# EAGLE schematic vibhub_0.1 (EAGLE 8.6.1)

## Sheet 1 of 2
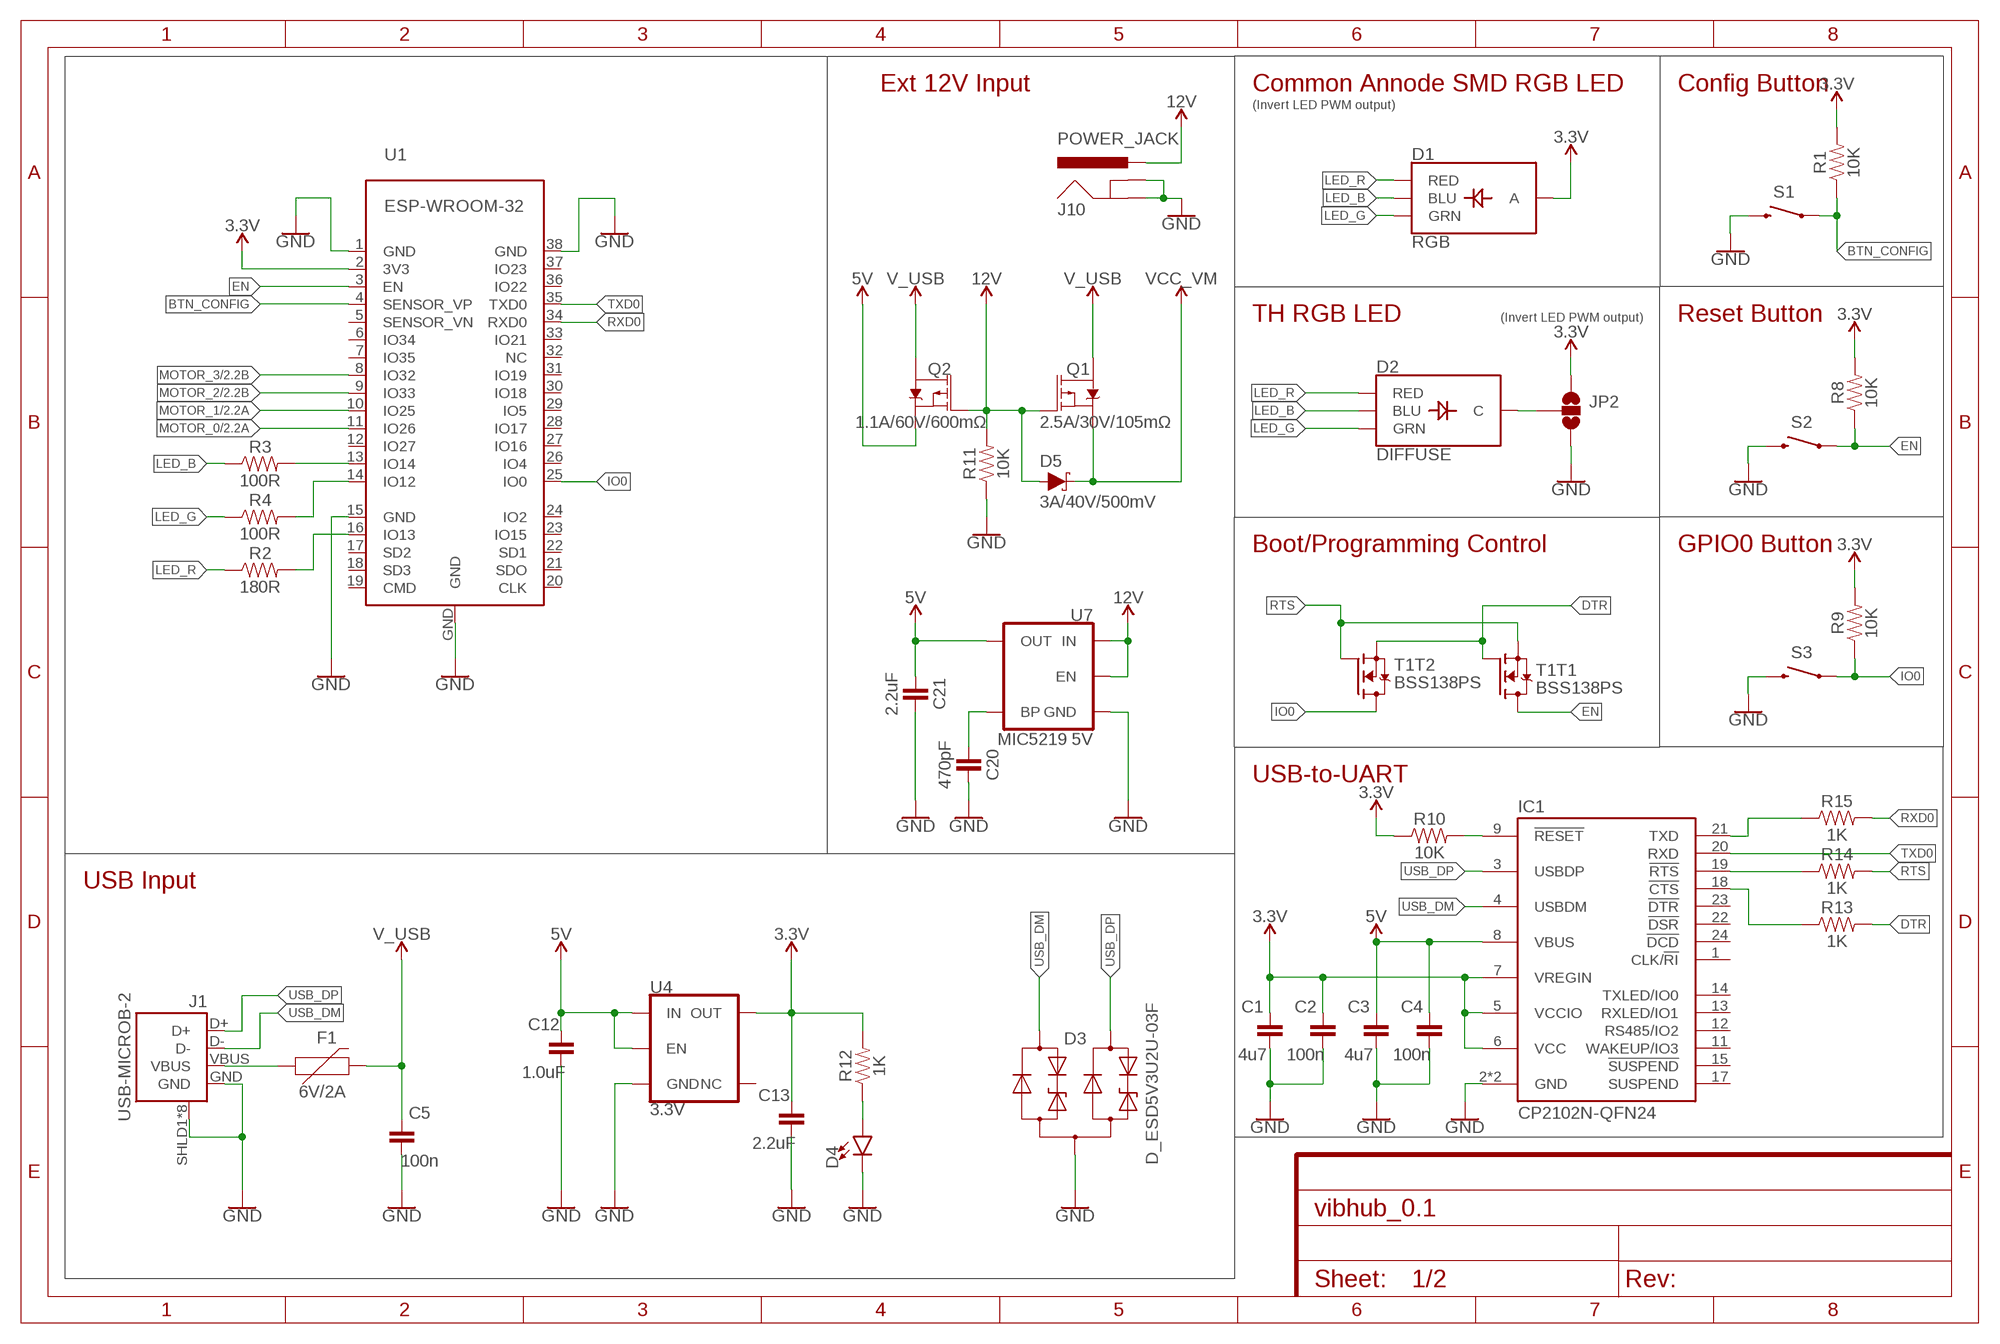
[diagram p0: schematic, sheet 1]
FRAME1 (FRAME-A4L): CNAME: VibHud ESP32; CREVISION: 0.1; DESIGNER: Kadah

### Parts
C1  4u7  CAPACITOR-1206  [C1206]
C2  100n  CAPACITOR-1206  [C1206]
C3  4u7  CAPACITOR-1206  [C1206]
C4  100n  CAPACITOR-1206  [C1206]
C5  100n  CAPACITOR-1206  [C1206]
C12  1.0uF  CAPACITOR-0805  [C0805]
C13  2.2uF  CAPACITOR-0805  [C0805]
C20  470pF  CAPACITOR-0805  [C0805]
C21  2.2uF  CAPACITOR-0805  [C0805]
D1  RGB  LED-RGB-CAPLCC  [P-LCC-4-3]
D2  DIFFUSE  LED-RGB-CCDIFFUSE  [LED-RGB-THRU]
D3  D_ESD5V3U2U-03F  [SOT723]
D4  LED1206  [LED-1206]
D5  3A/40V/500mV  DIODE-SCHOTTKY-B340A  [SMA-DIODE]
F1  6V/2A  PPTC_HALF-AMP  [1206]
IC1  CP2102N-QFN24  [QFN24-PAD]
J1  USB-MICROB-2  [USB-MICROB-10118194]
J10  POWER_JACK  [POWER_JACK_PTH]
JP2  JUMPER-SMT_3_NO_SILK  [SMT-JUMPER_3_NO_SILK]
Q1  2.5A/30V/105mΩ  MOSFET_PCH-DMG2307L  [SOT23-3]
Q2  1.1A/60V/600mΩ  MOSFET_PCH-SI2309DS  [SOT23-3]
R1  10K  RESISTOR0805  [0805]
R2  180R  RESISTOR0805  [0805]
R3  100R  RESISTOR0805  [0805]
R4  100R  RESISTOR0805  [0805]
R8  10K  RESISTOR0805  [0805]
R9  10K  RESISTOR0805  [0805]
R10  10K  RESISTOR0805  [0805]
R11  10K  RESISTOR0805  [0805]
R12  1K  RESISTOR0805  [0805]
R13  1K  RESISTOR0805  [0805]
R14  1K  RESISTOR0805  [0805]
R15  1K  RESISTOR0805  [0805]
S1  MOMENTARY-SWITCH-SPST-PTH-6.0MM  [TACTILE_SWITCH_PTH_6.0MM]
S2  MOMENTARY-SWITCH-SPST-PTH-6.0MM  [TACTILE_SWITCH_PTH_6.0MM]
S3  MOMENTARY-SWITCH-SPST-PTH-6.0MM  [TACTILE_SWITCH_PTH_6.0MM]
T1  BSS138PS  [SOT363]
U1  ESP-WROOM-32  [ESP-WROOM-32]
U4  3.3V  V_REG_AP2112K-3.3V  [SOT23-5]
U7  MIC5219 5V  V_REG_MIC52195V  [SOT23-5]

### Nets
3.3V: C1.1 C2.1 C13.1 D1.4(A) IC1.5(VCCIO) IC1.6(VCC) IC1.7(VREGIN) JP2.1 R1.2 R8.2 R9.2 R10.1 R12.2 U1.2(3V3) U4.5(OUT) ; also sheet 2
5V: C3.1 C4.1 C12.1 C21.2 IC1.8(VBUS) Q2.2(S) U4.1(IN) U4.3(EN) U7.5(OUT)
12V: D5.A J10.PWR Q1.1(G) Q2.1(G) R11.2 U7.1(IN) U7.3(EN)
BTN_CONFIG: R1.1 S1.1 U1.4(SENSOR_VP)
DTR: R13.2 T1.2(T1:G) T1.4(T2:S)
EN: R8.1 S2.1 T1.6(T1:D) U1.3(EN)
GND: C1.2 C2.2 C3.2 C4.2 C5.2 C12.2 C13.2 C20.1 C21.1 D3.3(A) D4.C IC1.2(GND) IC1.TP(GND) J1.GND J1.SHLD1(SHIELD) J1.SHLD2(SHIELD) J1.SHLD3(SHIELD) J1.SHLD4(SHIELD) J1.SHLD5(SHIELD) J1.SHLD6(SHIELD) J1.SHLD7(SHIELD) J1.SHLD8(SHIELD) J10.GND J10.GNDBREAK JP2.3 R11.1 S1.3 S2.3 S3.3 U1.1(GND) U1.15(GND) U1.38(GND) U1.GND U4.2(GND) U7.2(GND) ; also sheet 2
IO0: R9.1 S3.1 T1.3(T2:D) U1.25(IO0)
LED_B: D1.3(BLU) D2.4(BLU) R3.1
LED_G: D1.2(GRN) D2.3(GRN) R4.1
LED_R: D1.1(RED) D2.1(RED) R2.1
MOTOR_0: U1.11(IO26) ; also sheet 2
MOTOR_1: U1.10(IO25) ; also sheet 2
MOTOR_2: U1.9(IO33) ; also sheet 2
MOTOR_3: U1.8(IO32) ; also sheet 2
N$1: D2.2(C) JP2.2
N$3: R2.2 U1.16(IO13)
N$4: C20.2 U7.4(BP)
N$5: F1.1 J1.VBUS
N$7: IC1.9(!RESET) R10.2
N$8: IC1.21(TXD) R15.1
N$9: IC1.19(!RTS) R14.1
N$10: IC1.18(!CTS) R13.1
N$11: D4.A R12.1
N$12: R3.2 U1.13(IO14)
N$13: R4.2 U1.14(IO12)
RTS: R14.2 T1.1(T1:S) T1.5(T2:G)
RXD0: R15.2 U1.34(RXD0)
TXD0: IC1.20(RXD) U1.35(TXD0)
USB_DM: D3.1(C1) IC1.4(USBDM) J1.D-
USB_DP: D3.2(C2) IC1.3(USBDP) J1.D+
V_USB: C5.1 F1.2 Q1.3(D) Q2.3(D)
VCC_1: D5.C Q1.2(S) ; supply symbol labelled VCC_VM ; also sheet 2
Unconnected: IC1.1(CLK/!RI) IC1.11(WAKEUP/IO3) IC1.12(RS485/IO2) IC1.13(RXLED/IO1) IC1.14(TXLED/IO0) IC1.15(!SUSPEND) IC1.17(SUSPEND) IC1.22(!DSR) IC1.23(!DTR) IC1.24(!DCD) U1.5(SENSOR_VN) U1.6(IO34) U1.7(IO35) U1.12(IO27) U1.17(SD2) U1.18(SD3) U1.19(CMD) U1.20(CLK) U1.21(SDO) U1.22(SD1) U1.23(IO15) U1.24(IO2) U1.26(IO4) U1.27(IO16) U1.28(IO17) U1.29(IO5) U1.30(IO18) U1.31(IO19) U1.32(NC) U1.33(IO21) U1.36(IO22) U1.37(IO23) U4.4(NC)

### Notes on the sheet
- Ext 12V Input | Common Annode SMD RGB LED | Config Button
- (Invert LED PWM output)
- TH RGB LED | Reset Button
- (Invert LED PWM output)
- Boot/Programming Control | GPIO0 Button
- USB-to-UART
- USB Input

## Sheet 2 of 2
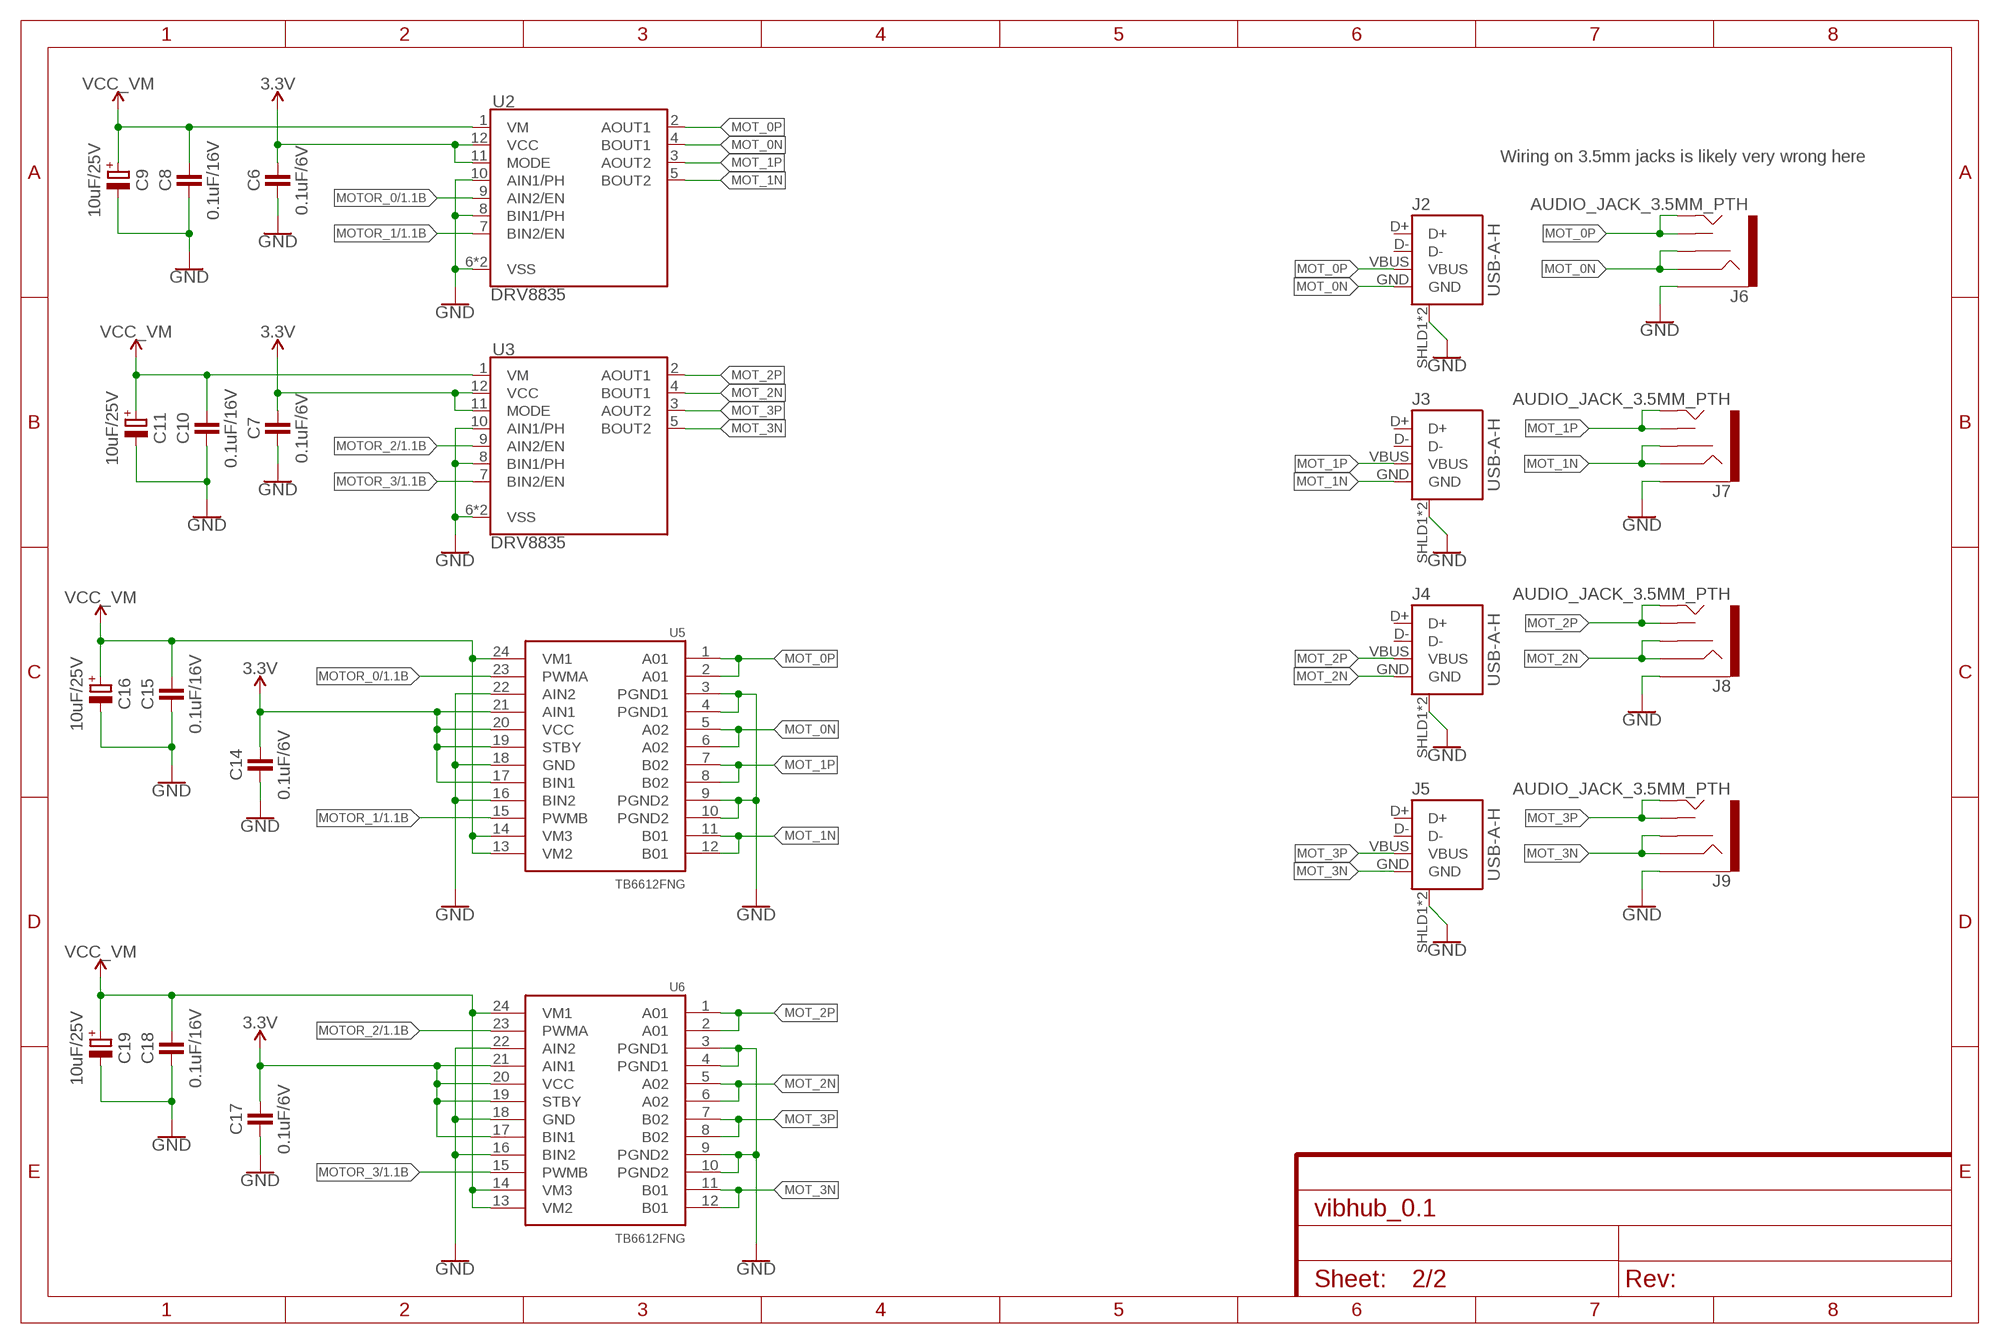
[diagram p1: schematic, sheet 2]
FRAME2 (FRAME-A4L): CNAME: VibHub Motors; CREVISION: 0.1; DESIGNER: Kadah

### Parts
C6  0.1uF/6V  CAPACITOR-0805  [C0805]
C7  0.1uF/6V  CAPACITOR-0805  [C0805]
C8  0.1uF/16V  CAPACITOR-1206  [C1206]
C9  10uF/25V  CAPACITOR_POL-E2-4  [E2-4]
C10  0.1uF/16V  CAPACITOR-1206  [C1206]
C11  10uF/25V  CAPACITOR_POL-E2-4  [E2-4]
C14  0.1uF/6V  CAPACITOR-0805  [C0805]
C15  0.1uF/16V  CAPACITOR-1206  [C1206]
C16  10uF/25V  CAPACITOR_POL-E2-4  [E2-4]
C17  0.1uF/6V  CAPACITOR-0805  [C0805]
C18  0.1uF/16V  CAPACITOR-1206  [C1206]
C19  10uF/25V  CAPACITOR_POL-E2-4  [E2-4]
J2  USB-A-H  [USB-A-H]
J3  USB-A-H  [USB-A-H]
J4  USB-A-H  [USB-A-H]
J5  USB-A-H  [USB-A-H]
J6  AUDIO_JACK_3.5MM_PTH  [AUDIO-JACK]
J7  AUDIO_JACK_3.5MM_PTH  [AUDIO-JACK]
J8  AUDIO_JACK_3.5MM_PTH  [AUDIO-JACK]
J9  AUDIO_JACK_3.5MM_PTH  [AUDIO-JACK]
U2  DRV8835  DRV883X  [WSON-12]
U3  DRV8835  DRV883X  [WSON-12]
U5  TB6612FNG  [SSOP24]
U6  TB6612FNG  [SSOP24]

### Nets
3.3V: C6.2 C7.2 C14.2 C17.2 U2.11(MODE) U2.12(VCC) U3.11(MODE) U3.12(VCC) U5.17(BIN1) U5.19(STBY) U5.20(VCC) U5.21(AIN1) U6.17(BIN1) U6.19(STBY) U6.20(VCC) U6.21(AIN1) ; also sheet 1
GND: C6.1 C7.1 C8.1 C9.- C10.1 C11.- C14.1 C15.1 C16.- C17.1 C18.1 C19.- J2.SHLD1(SHIELD) J2.SHLD2(SHIELD) J3.SHLD1(SHIELD) J3.SHLD2(SHIELD) J4.SHLD1(SHIELD) J4.SHLD2(SHIELD) J5.SHLD1(SHIELD) J5.SHLD2(SHIELD) J6.SLEEVE J7.SLEEVE J8.SLEEVE J9.SLEEVE U2.6(VSS) U2.8(BIN1/PH) U2.10(AIN1/PH) U2.PAD(VSS) U3.6(VSS) U3.8(BIN1/PH) U3.10(AIN1/PH) U3.PAD(VSS) U5.3(PGND1) U5.4(PGND1) U5.9(PGND2) U5.10(PGND2) U5.16(BIN2) U5.18(GND) U5.22(AIN2) U6.3(PGND1) U6.4(PGND1) U6.9(PGND2) U6.10(PGND2) U6.16(BIN2) U6.18(GND) U6.22(AIN2) ; also sheet 1
MOT_0N: J2.GND J6.RING J6.RSH U2.4(BOUT1) U5.5(A02) U5.6(A02)
MOT_0P: J2.VBUS J6.TIP J6.TSH U2.2(AOUT1) U5.1(A01) U5.2(A01)
MOT_1N: J3.GND J7.RING J7.RSH U2.5(BOUT2) U5.11(B01) U5.12(B01)
MOT_1P: J3.VBUS J7.TIP J7.TSH U2.3(AOUT2) U5.7(B02) U5.8(B02)
MOT_2N: J4.GND J8.RING J8.RSH U3.4(BOUT1) U6.5(A02) U6.6(A02)
MOT_2P: J4.VBUS J8.TIP J8.TSH U3.2(AOUT1) U6.1(A01) U6.2(A01)
MOT_3N: J5.GND J9.RING J9.RSH U3.5(BOUT2) U6.11(B01) U6.12(B01)
MOT_3P: J5.VBUS J9.TIP J9.TSH U3.3(AOUT2) U6.7(B02) U6.8(B02)
MOTOR_0: U2.9(AIN2/EN) U5.23(PWMA) ; also sheet 1
MOTOR_1: U2.7(BIN2/EN) U5.15(PWMB) ; also sheet 1
MOTOR_2: U3.9(AIN2/EN) U6.23(PWMA) ; also sheet 1
MOTOR_3: U3.7(BIN2/EN) U6.15(PWMB) ; also sheet 1
VCC_1: C8.2 C9.+ C10.2 C11.+ C15.2 C16.+ C18.2 C19.+ U2.1(VM) U3.1(VM) U5.13(VM2) U5.14(VM3) U5.24(VM1) U6.13(VM2) U6.14(VM3) U6.24(VM1) ; supply symbol labelled VCC_VM ; also sheet 1
Unconnected: J2.D+ J2.D- J3.D+ J3.D- J4.D+ J4.D- J5.D+ J5.D-

### Notes on the sheet
- Wiring on 3.5mm jacks is likely very wrong here

## Library data of the parts
C1-C8 C10 C12-C15 C17 C18 C20 C21 = vibhud:CAPACITOR: Capacitors ...2.2uF @ 6.3V -> 0402 ...4.7uF @ 6.3V -> 0603 ...10uF @ 16V -> 0805 ...22uF @ 25V -> 1206
C9 C11 C16 C19 = vibhud:CAPACITOR_POL: Polarized Capacitors
D1 = vibhud:LED-RGB-CA: LED-RGB Diffused Common Anode Packages: LED RGB-THRU P-LCC-4-3 LED-TRICOLOR-SMD SparkFun Products: RGB Diffused Common Anode- Diffuse <[https://www.sparkfun.com/products/10821]> RGB Diffused Common Anode - Clear <[https://www.sparkfun.com/products/10820]> Qduino Mini <[https://www.sparkfun.com/products/13614]> Triple Output LED RGB - SMD <https://www.sparkfun.com/products/7844>; PROD_ID: DIO-12986
D2 = vibhud:LED-RGB-CC: LED-RGB Common Cathode Packages: LED RGB-THRU LED_PIRANHA_5MM SparkFun Products: RGB Diffused Common Cathode- Diffuse <[https://www.sparkfun.com/products/9264]> RGB Diffused Common Cathode - Clear <[https://www.sparkfun.com/products/105]> LED-RGB 5mm Square (Piranha) <[https://www.sparkfun.com/products/11679]>; PROD_ID: DIO-09434
D3 = vibhud:D_ESD5V3U2U: TVS Diode - Uni-directional Ultra Low ESD / Transient Protection Diode Vrwm=5.3V, 0.4pF@1MHz; DIGIKEY: ESD5V3U2U-03F H6327DKR-ND
D4 = vibhud:LED: LED (Generic) Standard schematic elements and footprints for 5mm, 3mm, 1206, and 0603 sized LEDs. Generic LEDs with no color specified.
D5 = vibhud:DIODE-SCHOTTKY: Schottky diode A Schottky diode is a semiconductor diode which has a low forward voltage drop and a very fast switching action.; PROD_ID: DIO-09886
F1 = vibhud:PPTC: Resettable Fuse PPTC Resettable Fuse. Really a sort of resistor with a polymeric positive temperature coefficient whose resistance increases dramatically with an increase in temperature. When heated by the power passing through the resistance rises causing the current to be limited, protecting the circuit. This is achieved by the transition of the polymer from a crystalline to an amorphous state where the conductive carbon separates breaking the conductive pathways found in the cool crystalline structure. When a PPTC cools back down it resumes conducting letting the circuit turn back on. SparkFun Products: SparkFun RedBoard - Programmed with Arduino <https://www.sparkfun.com/products/12757> Pro Micro - 5V/16MHz <https://www.sparkfun.com/products/12640> Arduino Pro 328 - 5V/16MHz <https://www.sparkfun.com/products/10915> MP3 Trigger <https://www.sparkfun.com/products/13720>; PROD_ID: RES-08585; VALUE: 6V/0.5A
IC1 = vibhud:CP2102N: Silabs CP2102N USB to UART Bridge (5V tolerant inputs) CP2102N-QFN24 is pin-compatible with CP2104.
J1 = vibhud:USB: USB Connectors; DIGIKEY: 609-4618-6-ND
J2-J5 = vibhud:USB: USB Connectors
J6-J9 = vibhud:AUDIO_JACK_3.5MM: Audio Jack 3.5mm variants of PTH and SMT stereo audio jack with bypass switches. SparkFun Products: SparkFun SparkPunk Sound Kit <[https://www.sparkfun.com/products/11177]> - PTH MP3 Trigger <https://www.sparkfun.com/products/13720> -3.5mm SMD SparkFun PicoBoard <https://www.sparkfun.com/products/11888>- 2.5mm SMD; PROD_ID: CONN-08774; SF_ID: PRT-08032
J10 = vibhud:POWER_JACK: Power Jack Connector This is the standard 5.5mm barrel jack for power. The PTH is the most common, proven, reliable, footprint. The Slot footprint only works if the mill layer is transmitted to the PCB fab house so be warned. Here are the connectors we sell at SparkFun: DC Barrel Power Jack/Connector <https://www.sparkfun.com/products/119> (PRT-00119) DC Barrel Power Jack/Connector (SMD) <https://www.sparkfun.com/products/12748> (PRT-12748) DC Barrel Jack Adapter - Breadboard Compatible <https://www.sparkfun.com/products/10811> (PRT-10811) It is used on this SparkFun product (and many, many others): SparkFun RedBoard - Programmed with Arduino <https://www.sparkfun.com/products/12757> (DEV-12757) Also, if you need a mating power supply or connector, please check these out: Wall Adapter Power Supply - 9VDC 650mA <https://www.sparkfun.com/products/298> (TOL-00298) DC Barrel Jack Adapter - Male <https://www.sparkfun.com/products/10287> (PRT-10287); PROD_ID: CONN-08197
JP2 = vibhud:JUMPER-SMT_3_NO: Normally open jumper This jumper has three pads in close proximity to each other. Apply solder to close the connection(s).
Q1 = vibhud:MOSFET_PCH: P-channel MOSFETs Voltage controlled devices that allow control of high current outputs. SparkFun Products: SparkFun ESP32 Thing <https://www.sparkfun.com/products/13907> SparkFun ESP8266 Thing <https://www.sparkfun.com/products/13231>; PROD_ID: TRANS-11308
Q2 = vibhud:MOSFET_PCH: P-channel MOSFETs Voltage controlled devices that allow control of high current outputs. SparkFun Products: SparkFun ESP32 Thing <https://www.sparkfun.com/products/13907> SparkFun ESP8266 Thing <https://www.sparkfun.com/products/13231>; PROD_ID: TRANS-08285
R1-R4 R8-R15 = vibhud:RESISTOR: Generic Resistor Package
S1-S3 = vibhud:MOMENTARY-SWITCH-SPST: Momentary Switch (Pushbutton) - SPST Normally-open (NO) SPST momentary switches (buttons, pushbuttons). Variants PTH-12MM - 12mm square, through-hole Momentary Pushbutton Switch - 12mm Square <https://www.sparkfun.com/products/9190> (COM-09190) PTH-6.0MM, PTH-6.0MM-KIT - 6.0mm square, through-hole Mini Pushbutton Switch <https://www.sparkfun.com/products/97> (COM-00097) KIT package intended for soldering kit's - only one side of pads' copper is exposed. PTH-RIGHT-ANGLE-KIT - Right-angle, through-hole Right Angle Tactile Button <https://www.sparkfun.com/products/10791> - Used on SparkFun BigTime Watch Kit <https://www.sparkfun.com/products/11734> SMD-12MM - 12mm square, surface-mount Tactile Button - SMD (12mm) <https://www.sparkfun.com/products/12993> (COM-12993) Used on SparkFun PicoBoard <https://www.sparkfun.com/products/11888> SMD-4.5MM - 4.5mm Square Trackball Switch Used on SparkFun Blackberry Trackballer Breakout <https://www.sparkfun.com/products/13169> SMD-4.6MMX2.8MM - 4.60mm x 2.80mm, surface mount Used on SparkFun SAMD21 Mini Breakout <https://www.sparkfun.com/products/13664> SMD-5.2MM, SMD-5.2-REDUNDANT - 5.2mm square, surface-mount Mini Pushbutton Switch - SMD <https://www.sparkfun.com/products/8720> (COM-08720) Used on Arduino Pro Mini <https://www.sparkfun.com/products/11114> REDUNDANT package connects both switch circuits together SMD-6.0X3.5MM - 6.0 x 3.5mm, surface mount Momentary Reset Switch SMD <https://www.sparkfun.com/products/8229> (COM-08229) SMD-6.2MM-TALL - 6.2mm square, surface mount Tactile Button - SMD (6mm) <https://www.sparkfun.com/products/12992> Used on SparkFun Digital Sandbox <https://www.sparkfun.com/products/12651> SMD-RIGHT-ANGLE - Right-angle, surface mount Used on SparkFun Block for Intel® Edison - Arduino <https://www.sparkfun.com/products/13036>; PROD_ID: SWCH-08441; SF_SKU: COM-00097
T1 = vibhud:BSS138PS: Dual N-Channel MOSFET BSS138 (Vgs>=+/-20V, Vds>=40V, Id>=0.2A + Rds<=3Ohm @ Vgs=4.5V)
U1 = vibhud:ESP-WROOM-32
U2 U3 = vibhud:DRV883X: DRV8835 2 Channel Motor Driver Dual 1.5A H-bridge, 2-11V Datasheet <http://www.ti.com/lit/ds/symlink/drv8835.pdf> SparkFun Products: SparkFun Serial Controlled Motor Driver <https://www.sparkfun.com/products/13911>; PROD_ID: IC-13342
U4 = vibhud:V_REG_AP2112: AP2112 - 600mA CMOS LDO Regulator w/ Enable The AP2112 is CMOS process low dropout linear regulator with enable function, the regulator delivers a guaranteed 600mA (min.) continuous load current. Features Output Voltage Accuracy: ±1.5% Output Current: 600mA (Min.) Foldback Short Current Protection: 50mA Enable Function to Turn ON/OFF VOUT Low Dropout Voltage (3.3V): 250mV (Typ.) @IOUT=600mA Excellent Load Regulation: 0.2%/A (Typ.) Excellent Line Regulation: 0.02%/V (Typ.) Low Quiescent Current: 55μA (Typ.) Low Standby Current: 0.01μA (Typ.) Low Output Noise: 50μVRMS PSRR: 100Hz -65dB, 1kHz -65dB OTSD Protection Stable with 1.0μF Flexible Cap: Ceramic, Tantalum and Aluminum Electrolytic Operation Temperature Range: -40°C to 85°C ESD: MM 400V, HBM 4000V; PROD_ID: VREG-12457
U5 U6 = vibhud:TB6612FNG: Toshiba 1A dual motor driver IC-09363; PROD_ID: IC-09363
U7 = vibhud:V_REG_MIC5219: V_REG MIC5219 Standard 3.3V and 5V 500mA LDO voltage regulator in SOT-23 layout. Micrel part MIC5219. BP (by-pass) pin is used to lower output noise with 470pF cap, may be left open.; PROD_ID: VREG-10107